# EAGLE design v1.1 (EAGLE 9.6.2)

## Sheet 1 of 3: PIC32 CONNECTION
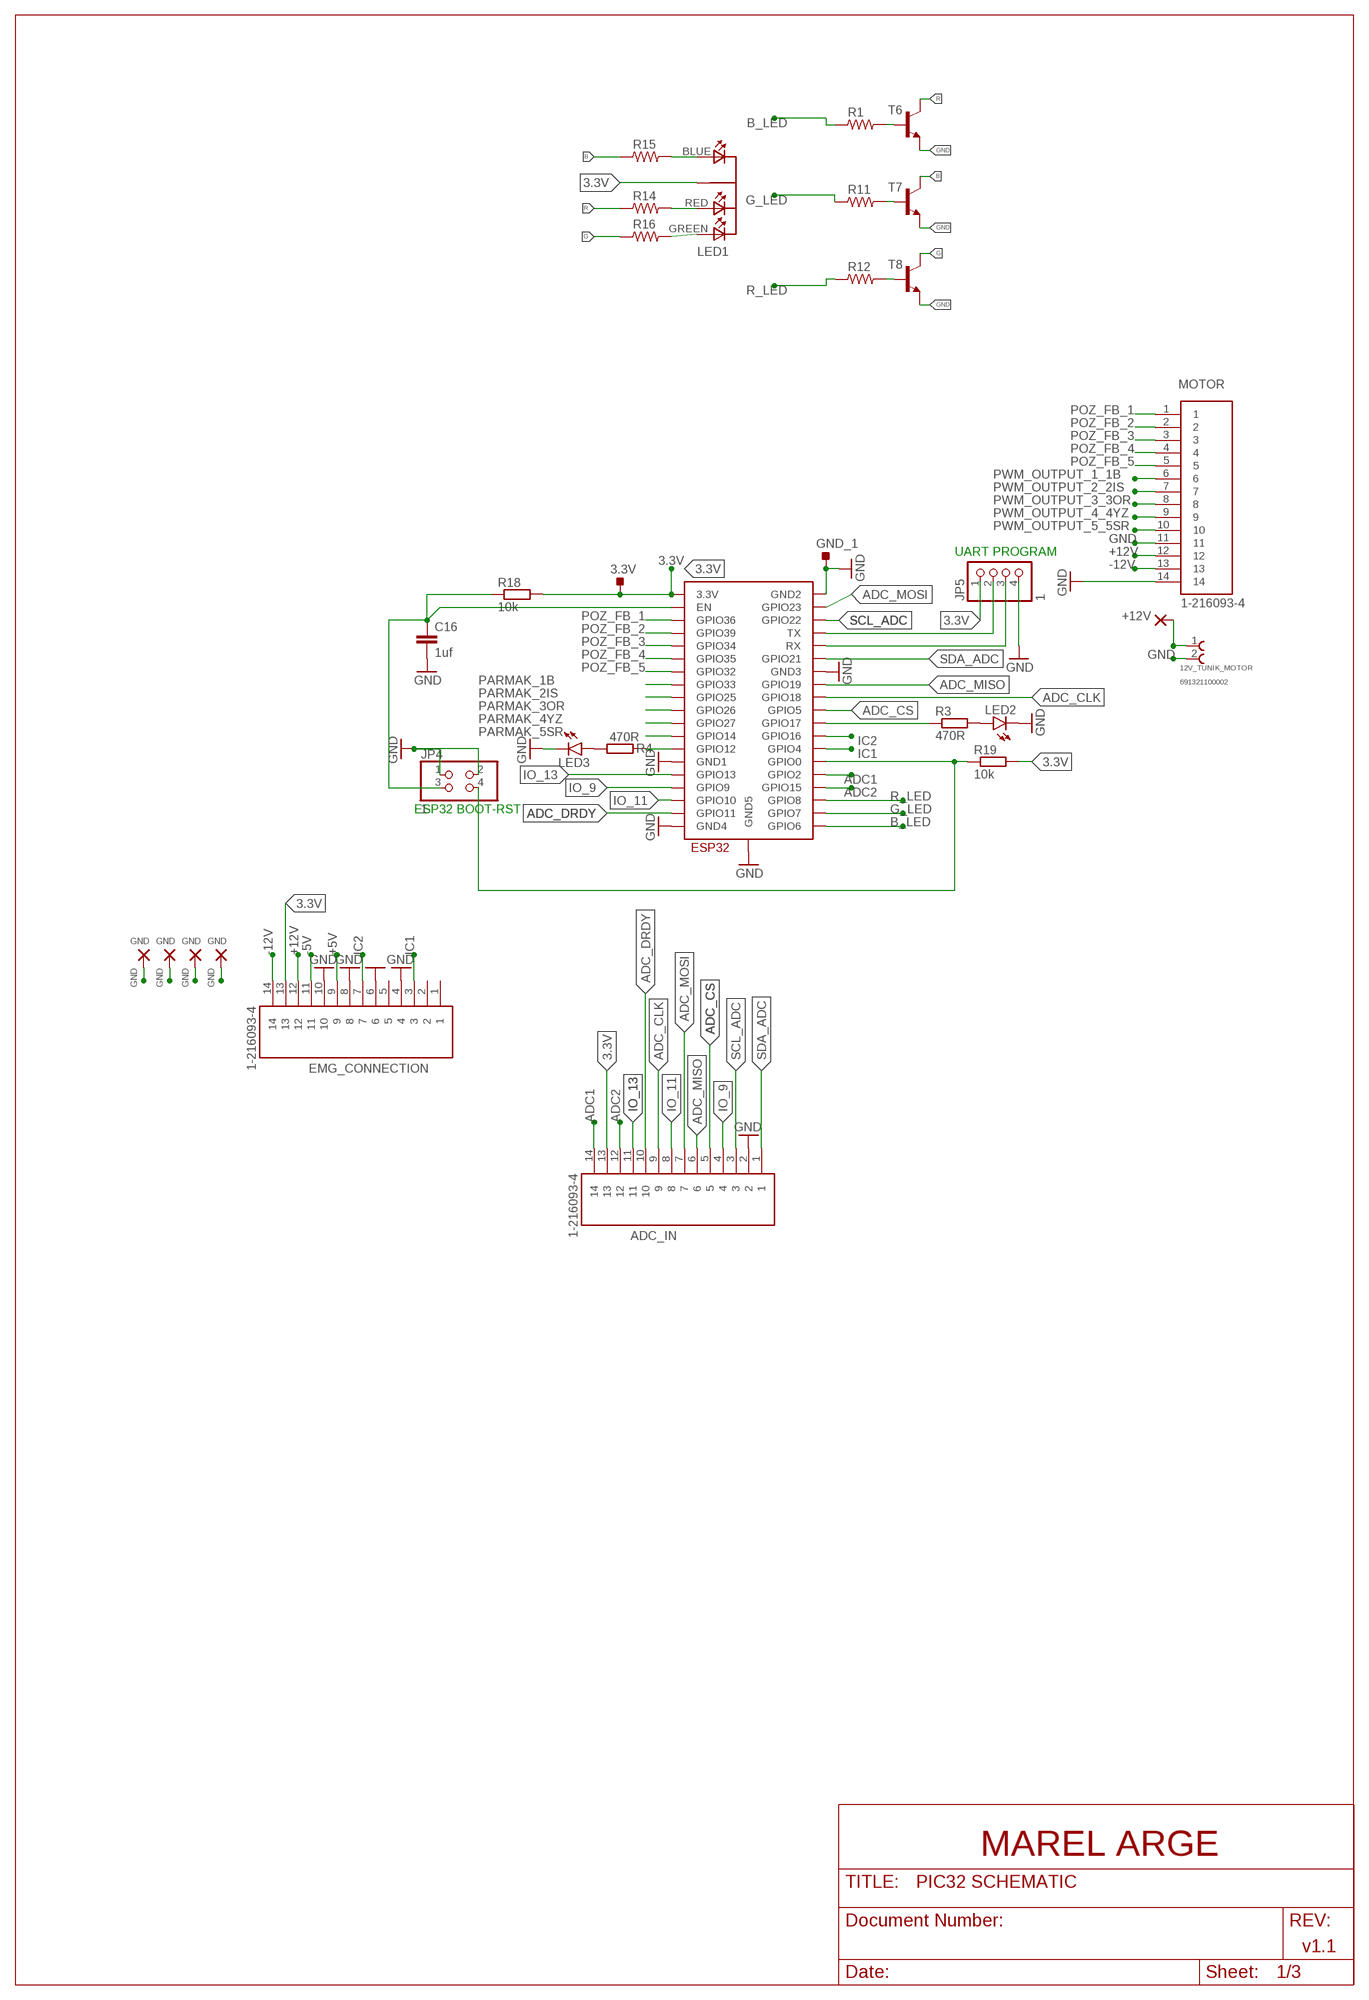
[diagram p0: schematic, sheet 1]
FRAME2 (DINA3_P): MAREL: ARGE

### Parts
3.3V  TESTPOINT_TPS-SMD-10SN  [TESTPOINT_SMD-10SN]
12V_TUNİK_MOTOR  691321100002  [691321100002]
12VOLT  12V  2,54/0,8  [2,54/0,8]
ADC_IN  1-216093-4  [TE_1-216093-4]
C16  1uf  C-EUC0805  [C0805]
EMG_CONNECTION  1-216093-4  [TE_1-216093-4]
GND18  GND  2,54/0,8  [2,54/0,8]
GND19  GND  2,54/0,8  [2,54/0,8]
GND20  GND  2,54/0,8  [2,54/0,8]
GND21  GND  2,54/0,8  [2,54/0,8]
GND_1  TESTPOINT_TPS-SMD-10SN  [TESTPOINT_SMD-10SN]
JP4  1  PINHD-2X2  [2X02]
JP5  1  PINHD-1X4  [1X04]
LED1  LED-DIP-3  [DIP-4]
LED2  LED5MM  [LED5MM]
LED3  LED5MM  [LED5MM]
MOTOR  1-216093-4  [TE_1-216093-4]
R1  100R  RC-MASTER-SMD_RESISTOR0603MP  [RC-MASTER-SMD_R0603MP]
R3  470R  R-EU_R0603  [R0603]
R4  470R  R-EU_R0603  [R0603]
R11  100R  RC-MASTER-SMD_RESISTOR0603MP  [RC-MASTER-SMD_R0603MP]
R12  100R  RC-MASTER-SMD_RESISTOR0603MP  [RC-MASTER-SMD_R0603MP]
R14  100R  RC-MASTER-SMD_RESISTOR0603MP  [RC-MASTER-SMD_R0603MP]
R15  100R  RC-MASTER-SMD_RESISTOR0603MP  [RC-MASTER-SMD_R0603MP]
R16  100R  RC-MASTER-SMD_RESISTOR0603MP  [RC-MASTER-SMD_R0603MP]
R18  10k  R-EU_R0603  [R0603]
R19  10k  R-EU_R0603  [R0603]
T6  TRANSISTORBC846BLT1SOT23-BEC  [SOT23-BEC]
T7  TRANSISTORBC846BLT1SOT23-BEC  [SOT23-BEC]
T8  TRANSISTORBC846BLT1SOT23-BEC  [SOT23-BEC]
U$7  ESP32-WROOM  [ESP32-WROOM]

### Nets
3.3V [power]: 3.3V.TP ADC_IN.13 EMG_CONNECTION.13 JP5.1 LED1.COMMON_CATHODE(COM-CATHODE) R18.2 R19.2 U$7.3V3(3.3V) ; also sheet 2
+5V [power]: EMG_CONNECTION.9 ; also sheet 2,3
+12V [power]: 12V_TUNİK_MOTOR.1 12VOLT.1(P) EMG_CONNECTION.12 MOTOR.12 ; also sheet 2
-5V [power]: EMG_CONNECTION.11 ; also sheet 2
-12V [power]: EMG_CONNECTION.14 MOTOR.13 ; also sheet 2
ADC1: ADC_IN.14 U$7.IO2(GPIO2)
ADC2: ADC_IN.12 U$7.IO15(GPIO15)
ADC_CLK: ADC_IN.9 U$7.IO18(GPIO18)
ADC_CS: ADC_IN.5 U$7.IO5(GPIO5)
ADC_DRDY: ADC_IN.10 U$7.CMD(GPIO11)
ADC_MISO: ADC_IN.6 U$7.IO19(GPIO19)
ADC_MOSI: ADC_IN.7 U$7.IO23(GPIO23)
B: R14.1 T7.C
B_LED: R1.1 U$7.CLK(GPIO6)
ESP32_RESET: C16.1 JP4.3 R18.1 U$7.EN
G: R16.1 T8.C
G_LED: R11.1 U$7.SD0(GPIO7)
GND [power]: 12V_TUNİK_MOTOR.2 ADC_IN.2 C16.2 EMG_CONNECTION.4 EMG_CONNECTION.6 EMG_CONNECTION.8 EMG_CONNECTION.10 GND18.1(P) GND19.1(P) GND20.1(P) GND21.1(P) GND_1.TP JP4.1 JP4.2 JP5.4 LED2.K(C) LED3.K(C) MOTOR.11 MOTOR.14 T6.E T7.E T8.E U$7.GND1 U$7.GND2 U$7.GND3 U$7.GND4 U$7.GND5 ; also sheet 2,3
IC1: EMG_CONNECTION.3 U$7.IO4(GPIO4)
IC2: EMG_CONNECTION.7 U$7.IO16(GPIO16)
IO_9: ADC_IN.4 U$7.SD2(GPIO9)
IO_11: ADC_IN.8 U$7.SD3(GPIO10)
IO_13: ADC_IN.11 U$7.IO13(GPIO13)
N$1: R11.2 T7.B
N$2: R1.2 T6.B
N$6: LED1.RED R14.2
N$7: R12.2 T8.B
N$11: LED1.BLUE R15.2
N$12: LED1.GREEN R16.2
N$16: JP5.2 U$7.TX
N$17: JP5.3 U$7.RX
N$18: JP4.4 R19.1 U$7.IO0(GPIO0)
N$19: LED2.A R3.2
N$20: R3.1 U$7.IO17(GPIO17)
N$21: LED3.A R4.2
N$22: R4.1 U$7.IO12(GPIO12)
PARMAK_1B: U$7.IO33(GPIO33) ; also sheet 3
PARMAK_2IS: U$7.IO25(GPIO25) ; also sheet 3
PARMAK_3OR: U$7.IO26(GPIO26) ; also sheet 3
PARMAK_4YZ: U$7.IO27(GPIO27) ; also sheet 3
PARMAK_5SR: U$7.IO14(GPIO14) ; also sheet 3
POZ_FB_1: MOTOR.1 U$7.SENSOR_VP(GPIO36)
POZ_FB_2: MOTOR.2 U$7.SENSOR_VN(GPIO39)
POZ_FB_3: MOTOR.3 U$7.IO34(GPIO34)
POZ_FB_4: MOTOR.4 U$7.IO35(GPIO35)
POZ_FB_5: MOTOR.5 U$7.IO32(GPIO32)
PWM_OUTPUT_1_1B: MOTOR.6 ; also sheet 3
PWM_OUTPUT_2_2IS: MOTOR.7 ; also sheet 3
PWM_OUTPUT_3_3OR: MOTOR.8 ; also sheet 3
PWM_OUTPUT_4_4YZ: MOTOR.9 ; also sheet 3
PWM_OUTPUT_5_5SR: MOTOR.10 ; also sheet 3
R: R15.1 T6.C
R_LED: R12.1 U$7.SD1(GPIO8)
SCL_ADC: ADC_IN.3 U$7.IO22(GPIO22)
SDA_ADC: ADC_IN.1 U$7.IO21(GPIO21)
Unconnected: EMG_CONNECTION.1 EMG_CONNECTION.2 EMG_CONNECTION.5

### Notes on the sheet
- UART PROGRAM
- ESP32 BOOT-RST
- -12V | +12V
- MAREL ARGE
- PIC32 SCHEMATIC

## Sheet 2 of 3: REGULATOR
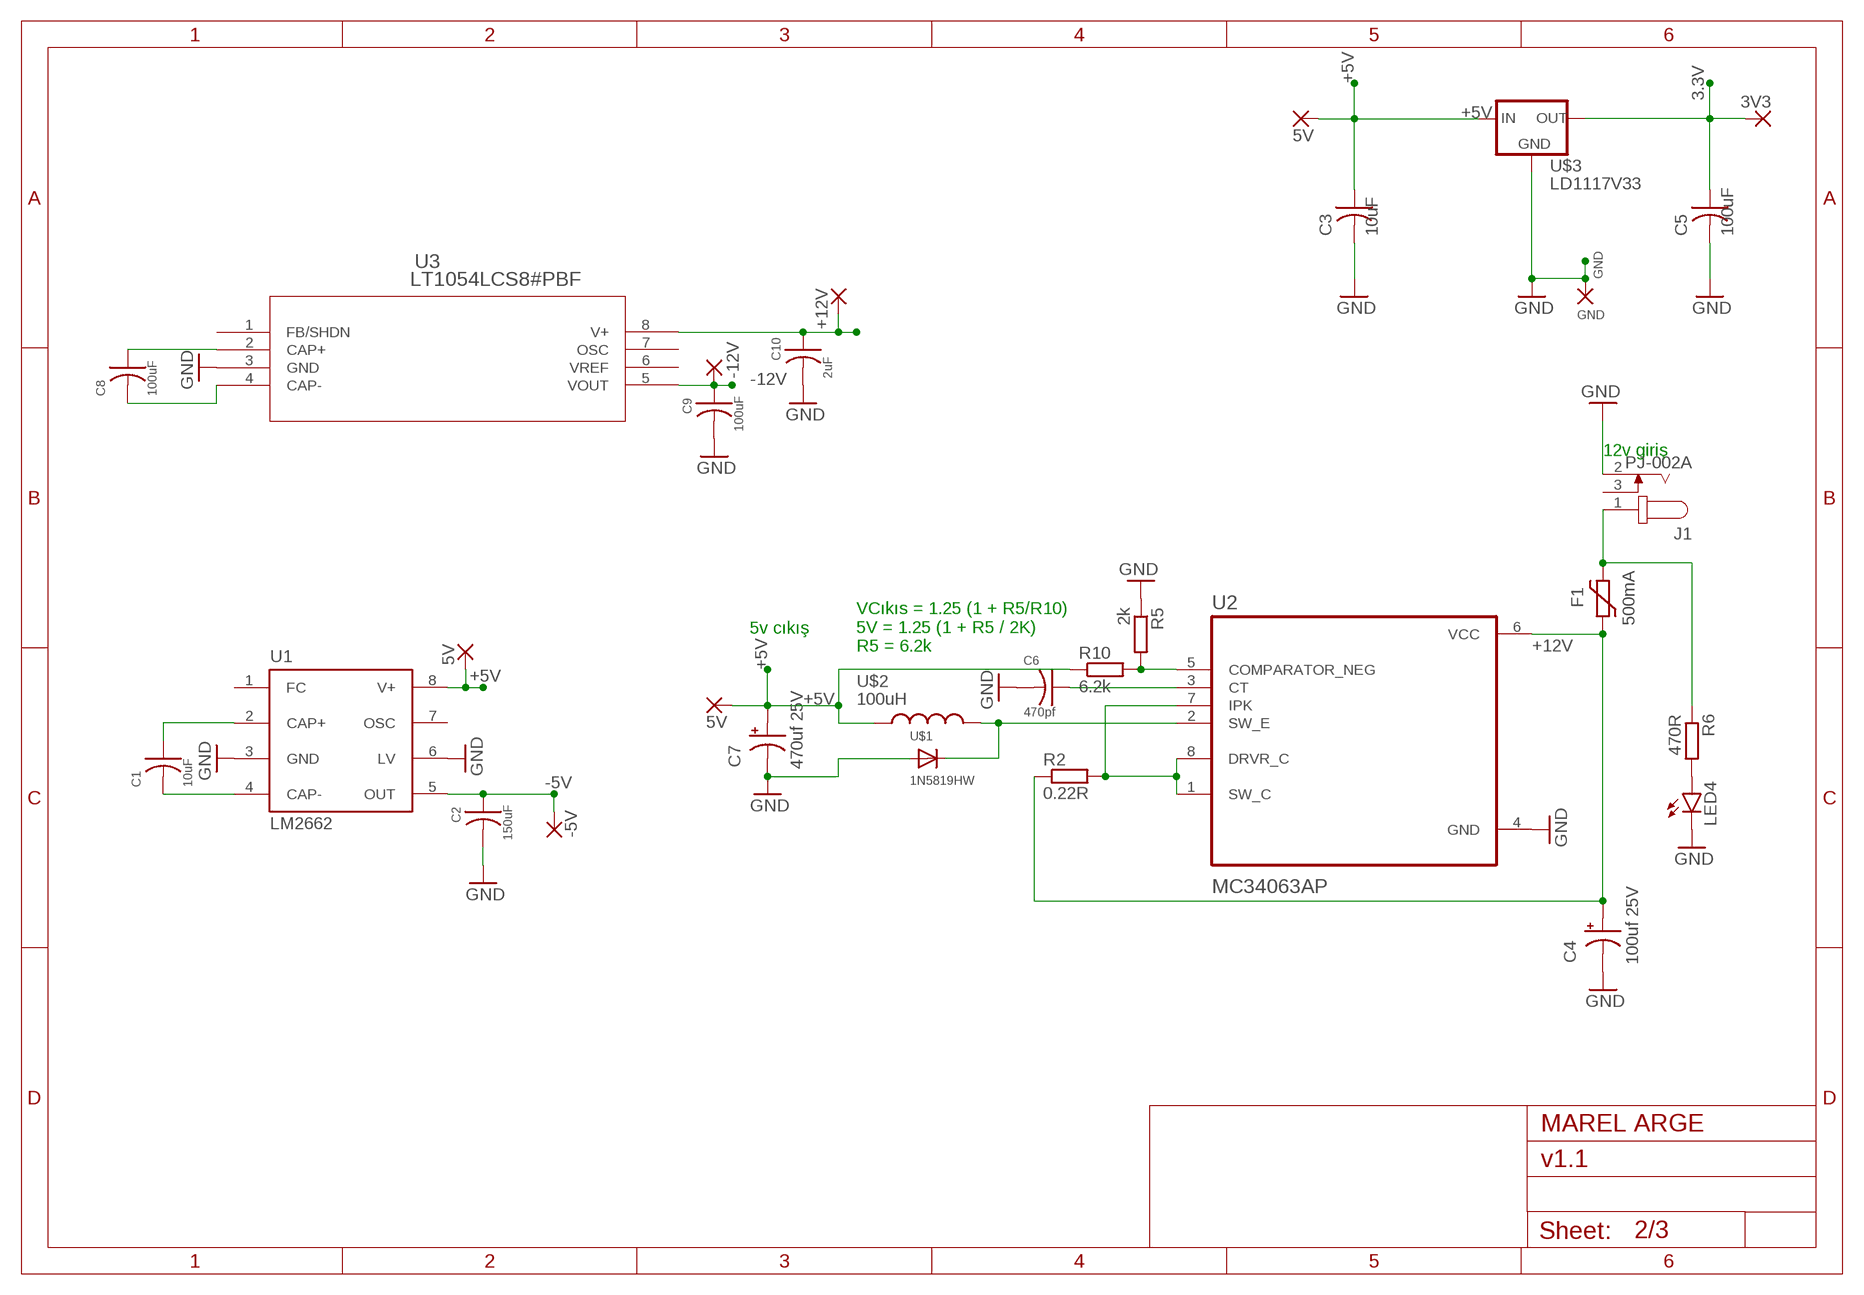
[diagram p1: schematic, sheet 2]

### Parts
3V3_1  3V3  2,54/0,8  [2,54/0,8]
5V  5V  2,54/0,8  [2,54/0,8]
5V1  5V  2,54/0,8  [2,54/0,8]
+5V  5V  2,54/0,8  [2,54/0,8]
+12V  +12V  2,54/0,8  [2,54/0,8]
-5V  -5V  2,54/0,8  [2,54/0,8]
-12V  -12V  2,54/0,8  [2,54/0,8]
C1  10uF  C-USC1206  [C1206]
C2  150uF  C-USC1206  [C1206]
C3  10uF  C-USC1206  [C1206]
C4  100uf 25V  T491X107K025AT  [X]
C5  100uF  C-USC1206  [C1206]
C6  470pf  C-USC1206  [C1206]
C7  470uf 25V  T491X107K025AT  [X]
C8  100uF  C-USC1206  [C1206]
C9  100uF  C-USC1206  [C1206]
C10  2uF  C-USC1206  [C1206]
F1  500mA  1206L  [1206L]
GND13  GND  2,54/0,8  [2,54/0,8]
J1  PJ-002A  [CUI_PJ-002A]
LED4  LED5MM  [LED5MM]
R2  0.22R  R-EU_R2512  [R2512]
R5  2k  R-EU_R0805  [R0805]
R6  470R  R-EU_R0603  [R0603]
R10  6.2k  R-EU_R0805  [R0805]
U1  LM2662  [SO08]
U2  MC34063AP  [DIP794W45P254L959H508Q8]
U3  LT1054LCS8#PBF  [SO-8_S]
U$1  1N5819HW  [SOD-123-EDITED]
U$2  100uH  INDUCTOR7070  [L7070]
U$3  LD1117V33  [LD1117V33]

### Nets
3.3V [power]: 3V3_1.1(P) C5.1 U$3.OUT ; also sheet 1
12_IN [power]: F1.P$2 J1.1 R6.1
+5V [power]: 5V1.1(P) 5V.1(P) +5V.1(P) C3.1 C7.A R10.1 U1.8(V+) U$2.1 U$3.IN ; also sheet 1,3
+12V [power]: +12V.1(P) C4.A C10.1 F1.P$1 R2.1 U2.6(VCC) U3.8(V+) ; also sheet 1
-5V [power]: -5V.1(P) C2.1 U1.5(OUT) ; also sheet 1
-12V [power]: -12V.1(P) C9.1 U3.5(VOUT) ; also sheet 1
GND [power]: C2.2 C3.2 C4.C C5.2 C6.2 C7.C C9.2 C10.2 GND13.1(P) J1.2 LED4.K(C) R5.1 U1.3(GND) U1.6(LV) U2.4(GND) U3.3(GND) U$1.A U$3.GND ; also sheet 1,3
N$3: C1.1 U1.2(CAP+)
N$4: C1.2 U1.4(CAP-)
N$5: R2.2 U2.1(SW_C) U2.7(IPK) U2.8(DRVR_C)
N$9: C8.1 U3.2(CAP+)
N$10: U2.2(SW_E) U$1.C U$2.2
N$13: R5.2 R10.2 U2.5(COMPARATOR_NEG)
N$14 [power]: C6.1 U2.3(CT)
N$15: C8.2 U3.4(CAP-)
N$25: LED4.A R6.2
Unconnected: J1.3 U1.1(FC) U1.7(OSC) U3.1(FB/SHDN) U3.7(OSC)

### Notes on the sheet
- 12v giriş
- 5v cıkış
- VCıkıs = 1.25 (1 + R5/R10) 
  5V = 1.25 (1 + R5 / 2K) 
  R5 = 6.2k
- MAREL ARGE

## Sheet 3 of 3: MOTOR DRIVER
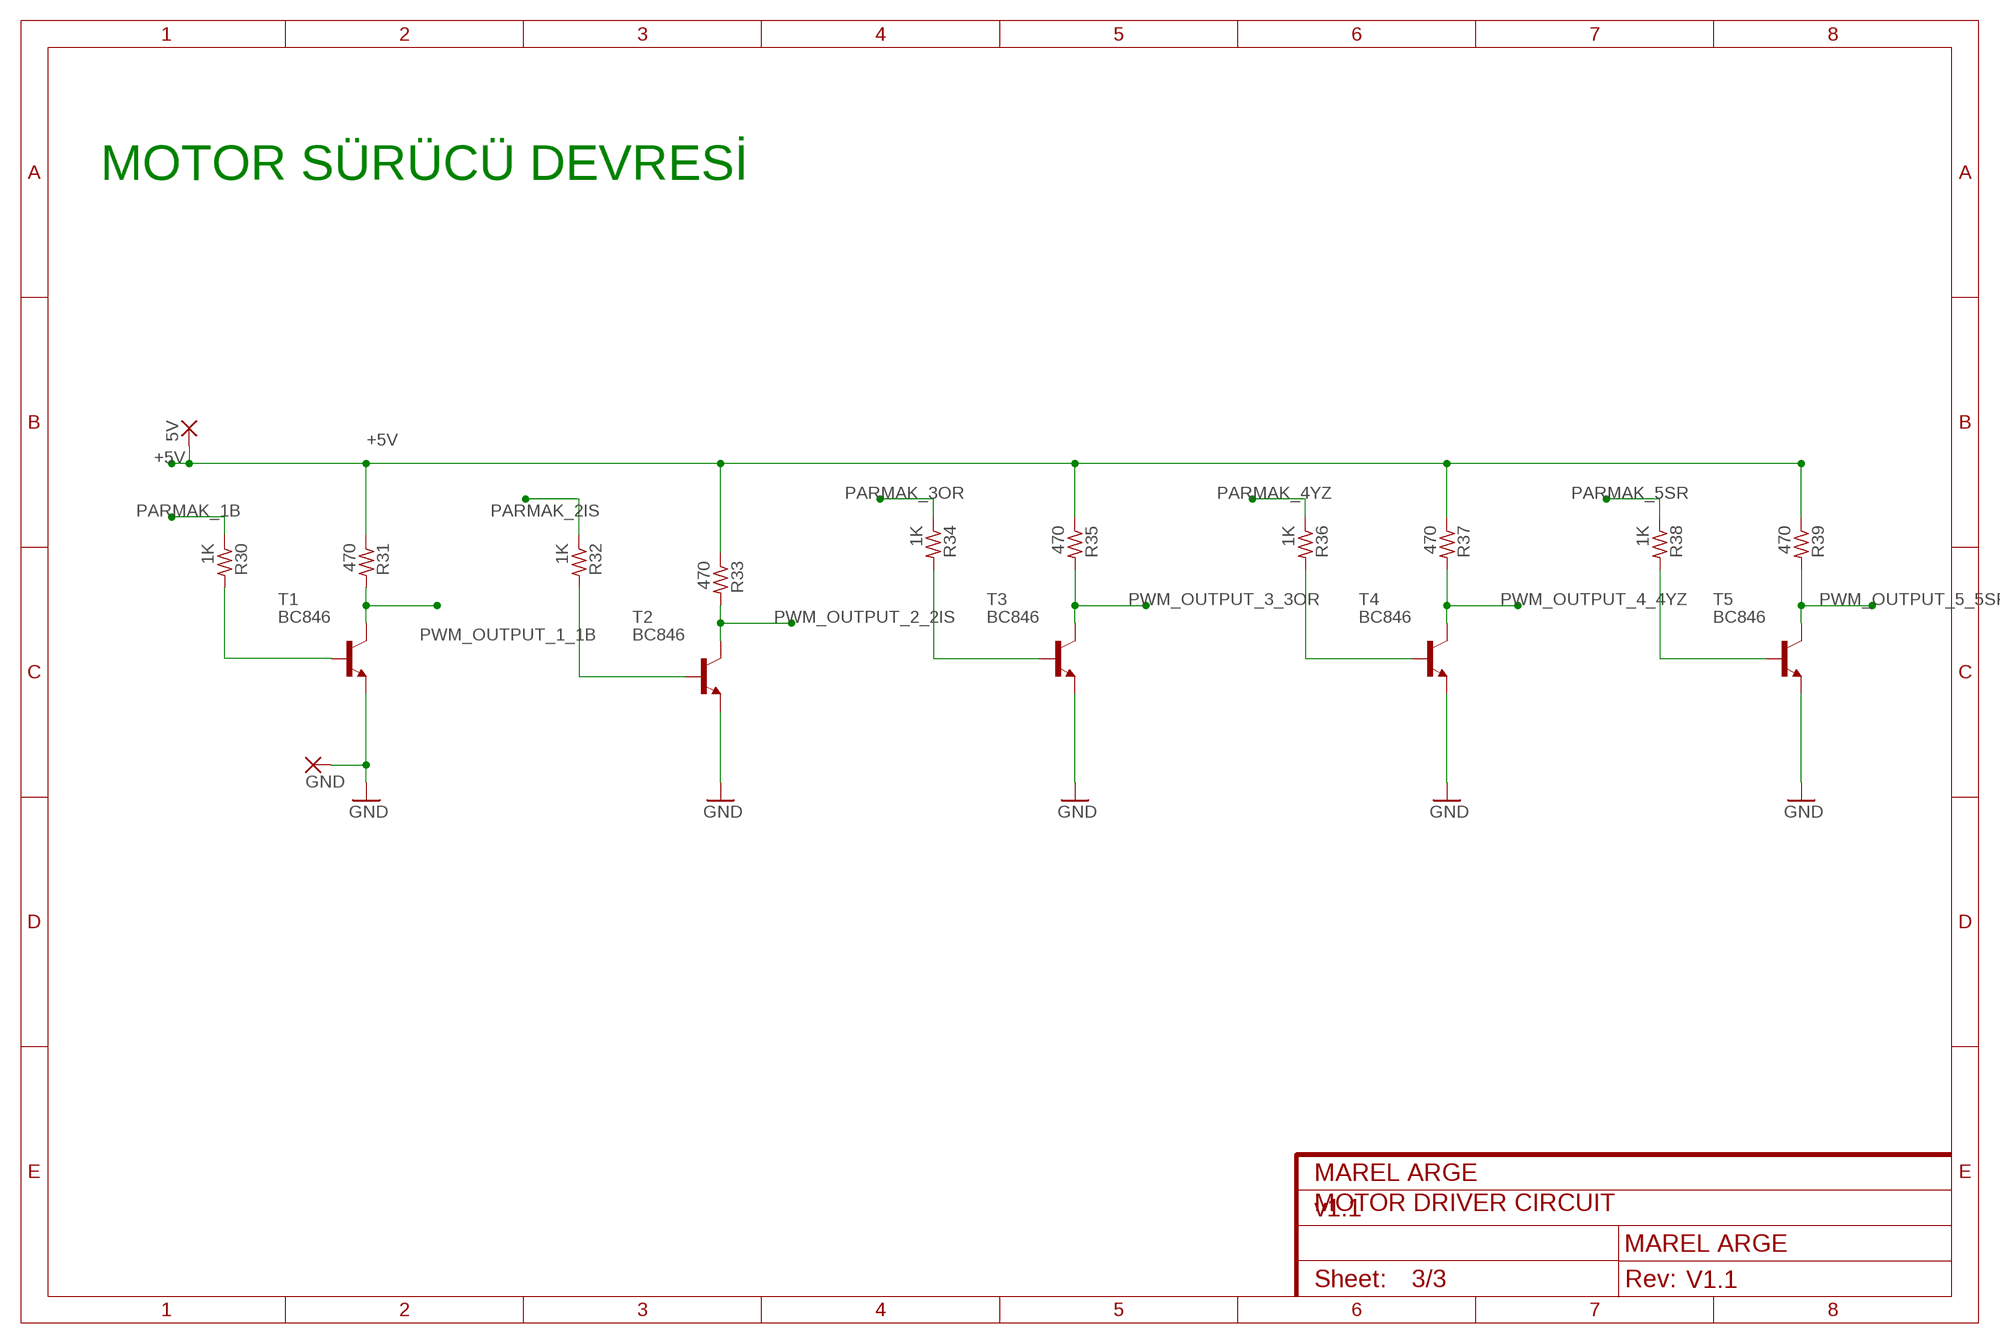
[diagram p2: schematic, sheet 3]
FRAME4 (FRAME-A4L): CNAME: MAREL ARGE; CREVISION: V1.1; DESIGNER: MAREL ARGE; TITLE: MOTOR DRIVER CIRCUIT

### Parts
_5VOLT  5V  2,54/0,8  [2,54/0,8]
GND_  GND  2,54/0,8  [2,54/0,8]
R30  1K  R-US_M0805  [M0805]
R31  470  R-US_M0805  [M0805]
R32  1K  R-US_M0805  [M0805]
R33  470  R-US_M0805  [M0805]
R34  1K  R-US_M0805  [M0805]
R35  470  R-US_M0805  [M0805]
R36  1K  R-US_M0805  [M0805]
R37  470  R-US_M0805  [M0805]
R38  1K  R-US_M0805  [M0805]
R39  470  R-US_M0805  [M0805]
T1  BC846  [SOT23]
T2  BC846  [SOT23]
T3  BC846  [SOT23]
T4  BC846  [SOT23]
T5  BC846  [SOT23]

### Nets
+5V [power]: _5VOLT.1(P) R31.1 R33.1 R35.1 R37.1 R39.1 ; also sheet 1,2
GND [power]: GND_.1(P) T1.2(E) T2.2(E) T3.2(E) T4.2(E) T5.2(E) ; also sheet 1,2
N$45: R30.2 T1.1(B)
N$46: R32.2 T2.1(B)
N$47: R34.2 T3.1(B)
N$48: R36.2 T4.1(B)
N$49: R38.2 T5.1(B)
PARMAK_1B: R30.1 ; also sheet 1
PARMAK_2IS: R32.1 ; also sheet 1
PARMAK_3OR: R34.1 ; also sheet 1
PARMAK_4YZ: R36.1 ; also sheet 1
PARMAK_5SR: R38.1 ; also sheet 1
PWM_OUTPUT_1_1B: R31.2 T1.3(C) ; also sheet 1
PWM_OUTPUT_2_2IS: R33.2 T2.3(C) ; also sheet 1
PWM_OUTPUT_3_3OR: R35.2 T3.3(C) ; also sheet 1
PWM_OUTPUT_4_4YZ: R37.2 T4.3(C) ; also sheet 1
PWM_OUTPUT_5_5SR: R39.2 T5.3(C) ; also sheet 1

### Notes on the sheet
- MOTOR SÜRÜCÜ DEVRESİ

## Power pins joined to a net without a drawn wire
VREF: U3.6(VREF)

## Library data of the parts
3.3V GND_1 = Mareltek Detector Hand Library:TESTPOINT_TPS: TEST POINT PAD; BOM: EXCLUDE
3V3_1 5V 5V1 12VOLT +5V +12V -5V -12V _5VOLT GND13 GND18-GND21 GND_ = wirepad:2,54/0,8: THROUGH-HOLE PAD
12V_TUNİK_MOTOR = 691321100002:691321100002: WR-TBL Serie 3211 - 3.50mm Vertical PCB Header , 2 Pins Con_TBL_Pluggable_3.50_PCB_V_6913211000xx_691321100002 <http://katalog.we-online.de/media/images/eican/Con_TBL_Pluggable_3.50_PCB_V_6913211000xx_pf2.jpg> Details see: http://katalog.we-online.de/en/em/TBL_3_50_3211_VERTICAL_PCB_HEADER_69132110000X Created 2014-12-22, aslant tao 2014 (C) Würth Elektronik; AVAILABILITY: Unavailable; DESCRIPTION: 2 Position Terminal Block Header, Male Pins, Shrouded _4 Side_ 0.138 _3.50mm_ Vertical Through Hole; MF: Wurth Electronics; MP: 691321100002; PACKAGE: None; PRICE: None
ADC_IN EMG_CONNECTION MOTOR = 1-216093-4:1-216093-4; AVAILABILITY: Unavailable; CENTERLINE_PITCH: 2.54 mm[.1 in]; COMMENT: 1-216093-4; DESCRIPTION: Conn IDC Connector PL 14 POS 2.54mm IDT RA Cable Mount Loose Piece; EU_ROHS_COMPLIANCE: Compliant; MF: TE Connectivity; MP: 1-216093-4; NUMBER_OF_POSITIONS: 14; PACKAGE: None; PRICE: None; PRODUCT_TYPE: Connector; TE_PURCHASE_URL: https://www.te.com/usa-en/product-1-216093-4.html?te_bu=Cor&te_type=disp&te_campaign=seda_glo_cor-seda-global-disp-prtnr-fy19-seda-model-bom-cta_sma-317_1&elqCampaignId=32493
C1-C3 C5 C6 C8-C10 = adafruit:C-US: CAPACITOR, American symbol
C4 C7 = Volks73-Kemet:T491?*: Tantalum Surface Mount Capacitor - Standard Tantalum T491 Series Industrial Grade MnO2 Documentation Datasheet <http://www.kemet.com/Lists/ProductCatalog/Attachments/254/KEM_T2005_T491.pdf> Overview The KEMET T491 Series, designed specifially for today’s highly automated surface mount processes and equipment, is the leading choice for surface mount designs. The T491 combines KEMET’s proven solid tantalum technology, acclaimed and respected throughout the world, with the latest in materials, processes and automation, resulting in unsurpassed total performance and value. This product meets or exceeds the requirements of EIA standard 535BAAC. This series is classifid as MSL (Moisture Sensitivity Level) 1 under J STD 020: unlimited flor life time at ≤30°C / 85% RH. The T491 standard terminations are available in 100% matte tin and provide excellent wetting characteristics and compatibility with today's surface mount solder systems. Tin/lead (Sn/Pb) terminations are available upon request for any part number. Gold-plated terminations are also available for use with conductive epoxy attachment processes. Standard packaging of these devices is tape and reel in accordance with EIA 481. This system provides perfect compatibility with all tape-fed placement units. Benefits Meets or exceeds EIA Standard 535BAAC Taped and reeled per EIA 481 Symmetrical, compliant terminations Optional gold-plated terminations Laser-marked case 100% surge current test on C, D, E, U, V, X sizes Halogen free epoxy Capacitance 0.1 µF to 1,000 µF Tolerance ±10%, ±20% Voltage 2.5 – 50 VDC Extended range values Low profie case sizes RoHS Compliant and lead-free terminations (See www.kemet.com for transition information) Operating temperature: -55ºC to +125ºC; CAPACITANCE: 100uF; CATEGORY: Capacitors; DESCRIPTION: CAP TANT 100UF 25V 10% 2917; DOCUMENTATION_LINK: <a href="http://www.kemet.com/Lists/ProductCatalog/Attachments/254/KEM_T2005_T491.pdf">Datasheet</a>; DOCUMENTATION_URL: http://www.kemet.com/Lists/ProductCatalog/Attachments/254/KEM_T2005_T491.pdf; ESR: 300 mOhm; FAMILY: Tantalum Capacitors; FEATURES: General Purpose; HEIGHT-SEATED: 0.169" (4.30mm); LEAD_SPACING: -; MANUFACTURER: Kemet; MANUFACTURER_SIZE_CODE: X; MOUNTING_TYPE: Surface Mount; OPERATING_TEMPERATURE: -55C ~ 125C; PACKAGE: 2917 (7343 Metric); PART_NUMBER: T491X107K025AT; SERIES: T491; SIZE: 0.287" L x 0.169" W (7.30mm x 4.30mm); SUPPLIER_ITEM_INFO: http://www.digikey.com/product-detail/en/T491X107K025AT/399-8410-1-ND/3472133; SUPPLIER_ITEM_LINK: <a href="">Details</a>; SUPPLIER_ITEM_NUMBER: 399-8410-1-ND; SUPPLIER_LINK: <a href="http://www.digikey.com">Home Page</a>; SUPPLIER_NAME: Digi-Key; SUPPLIER_URL: http://www.digikey.com; TOLERANCE: 10%; TYPE: Molded; VOLTAGE-RATED: 25V
C16 = rcl:C-EU: CAPACITOR, European symbol; SPICEPREFIX: C
F1 = ptc-littlefuse:1206L
J1 = PJ-002A:PJ-002A: 2.0 mm Center Pin, 2.5 A, Right Angle, Through Hole, Dc Power Jack Connector Check availability <https://pricing.snapeda.com/parts/PJ-002A/CUI%20Devices/view-part?ref=eda>; AVAILABILITY: In Stock; CHECK_PRICES: https://www.snapeda.com/parts/PJ-002A/CUI+Devices/view-part/?ref=eda; CUI_PURCHASE_URL: https://www.cuidevices.com/product/interconnect/connectors/dc-power-connectors/jacks/pj-002a?utm_source=snapeda.com&utm_medium=referral&utm_campaign=snapedaBOM; DESCRIPTION: 2.0 x 6.5 mm, 2.5 A, Horizontal, Through Hole, Dc Power Jack Connector; MF: CUI Devices; MP: PJ-002A; PACKAGE: None; PRICE: None; PURCHASE-URL: https://www.snapeda.com/api/url_track_click_mouser/?unipart_id=287588&manufacturer=CUI Devices&part_name=PJ-002A&search_term=None; SNAPEDA_LINK: https://www.snapeda.com/parts/PJ-002A/CUI+Devices/view-part/?ref=snap
JP4 = pinhead:PINHD-2X2: PIN HEADER
JP5 = pinhead:PINHD-1X4: PIN HEADER
LED1 = _led-rgb:LED-DIP-3: RGB DIP LED Edited: brunql DIP 4 Pin Special for AmbilightUSB
LED2-LED4 = led:LED: LED OSRAM: - CHIPLED LG R971, LG N971, LY N971, LG Q971, LY Q971, LO R971, LY R971 LH N974, LH R974 LS Q976, LO Q976, LY Q976 LO Q996 - Hyper CHIPLED LW Q18S LB Q993, LB Q99A, LB R99A - SideLED LS A670, LO A670, LY A670, LG A670, LP A670 LB A673, LV A673, LT A673, LW A673 LH A674 LY A675 LS A676, LA A676, LO A676, LY A676, LW A676 LS A679, LY A679, LG A679 - Hyper Micro SIDELED® LS Y876, LA Y876, LO Y876, LY Y876 LT Y87S - SmartLED LW L88C, LW L88S LB L89C, LB L89S, LG L890 LS L89K, LO L89K, LY L89K LS L896, LA L896, LO L896, LY L896 - TOPLED LS T670, LO T670, LY T670, LG T670, LP T670 LSG T670, LSP T670, LSY T670, LOP T670, LYG T670 LG T671, LOG T671, LSG T671 LB T673, LV T673, LT T673, LW T673 LH T674 LS T676, LA T676, LO T676, LY T676, LB T676, LH T676, LSB T676, LW T676 LB T67C, LV T67C, LT T67C, LS T67K, LO T67K, LY T67K, LW E67C LS E67B, LA E67B, LO E67B, LY E67B, LB E67C, LV E67C, LT E67C LW T67C LS T679, LY T679, LG T679 LS T770, LO T770, LY T770, LG T770, LP T770 LB T773, LV T773, LT T773, LW T773 LH T774 LS E675, LA E675, LY E675, LS T675 LS T776, LA T776, LO T776, LY T776, LB T776 LHGB T686 LT T68C, LB T68C - Hyper Mini TOPLED® LB M676 - Mini TOPLED Santana® LG M470 LS M47K, LO M47K, LY M47K Source: http://www.osram.convergy.de LUXEON: - LUMILED® LXK2-PW12-R00, LXK2-PW12-S00, LXK2-PW14-U00, LXK2-PW14-V00 LXK2-PM12-R00, LXK2-PM12-S00, LXK2-PM14-U00 LXK2-PE12-Q00, LXK2-PE12-R00, LXK2-PE12-S00, LXK2-PE14-T00, LXK2-PE14-U00 LXK2-PB12-K00, LXK2-PB12-L00, LXK2-PB12-M00, LXK2-PB14-N00, LXK2-PB14-P00, LXK2-PB14-Q00 LXK2-PR12-L00, LXK2-PR12-M00, LXK2-PR14-Q00, LXK2-PR14-R00 LXK2-PD12-Q00, LXK2-PD12-R00, LXK2-PD12-S00 LXK2-PH12-R00, LXK2-PH12-S00 LXK2-PL12-P00, LXK2-PL12-Q00, LXK2-PL12-R00 Source: www.luxeon.com KINGBRIGHT: KA-3528ASYC Source: www.kingbright.com
R1 R11 R12 R14-R16 = Mareltek Detector Hand Library:RC-MASTER-SMD_RESISTOR: RESISTOR; SPICEPREFIX: R
R2-R6 R10 R18 R19 = rcl:R-EU_: RESISTOR, European symbol; SPICEPREFIX: R
R30-R39 = Saldiyos_Lbr:R-US_: RESISTOR, American symbol
T1-T5 = transistor:BC846: NPN TRANSISTOR
T6-T8 = Mareltek Detector Hand Library:TRANSISTOR: NPN Transistror BF959 corrected 2008.03.06
U1 = bt_regulator:LM2662: The LM2662/LM2663 CMOS charge-pump voltage converter inverts a positive voltage in the range of 1.5V to 5.5 V to the corresponding negative voltage. The LM2662/LM2663 uses two low cost capacitors to provide 200 mA of output current without the cost, size, and EMI related to inductor based converters. With an operating current of only 300 μA and operating efficiency greater than 90% at most loads, the LM2662/LM2663 provides ideal performance for battery powered systems. The LM2662/LM2663 may also be used as a positive voltage doubler. datasheet.pdf <https://rocelec.widen.net/view/pdf/cenmqdu1m5/lm2662.pdf?t.download=true&u=5oefqw>
U2 = MC34063AP:MC34063AP: Check availability <https://pricing.snapeda.com/parts/MC34063AP/Texas%20Instruments/view-part?ref=eda>; AVAILABILITY: In Stock; CHECK_PRICES: https://www.snapeda.com/parts/MC34063AP/Texas+Instruments/view-part/?ref=eda; DESCRIPTION: 1.5-A boost, buck, inverting switching regulator, operation from 0°C to 70°C; MF: Texas Instruments; MP: MC34063AP; PACKAGE: PDIP-8 Texas; PRICE: None; PURCHASE-URL: https://www.snapeda.com/api/url_track_click_mouser/?unipart_id=4800532&manufacturer=Texas Instruments&part_name=MC34063AP&search_term=None; SNAPEDA_LINK: https://www.snapeda.com/parts/MC34063AP/Texas+Instruments/view-part/?ref=snap
U3 = LT1054LCS8_PBF:LT1054LCS8#PBF: Check availability <https://pricing.snapeda.com/parts/LT1054LCS8%23PBF/Analog%20Devices/view-part?ref=eda>; AVAILABILITY: In Stock; CHECK_PRICES: https://www.snapeda.com/parts/LT1054LCS8%23PBF/Analog+Devices/view-part/?ref=eda; DESCRIPTION: Charge Pump Switching Regulator IC Positive or Negative Adjustable (Fixed) 2.5V (-Vin, 2Vin) 1 Output 120mA 8-SOIC (0.154, 3.90mm Width); MF: Analog Devices; MP: LT1054LCS8#PBF; PACKAGE: SO-8 Linear Technology; PRICE: None; PURCHASE-URL: https://www.snapeda.com/api/url_track_click_mouser/?unipart_id=596549&manufacturer=Analog Devices&part_name=LT1054LCS8#PBF&search_term=None; SNAPEDA_LINK: https://www.snapeda.com/parts/LT1054LCS8%23PBF/Analog+Devices/view-part/?ref=snap
U$1 = MTM_untested:1N5819HW
U$2 = smd-inductors:INDUCTOR
U$3 = LD1117V33:LD1117V33
U$7 = ESP32:ESP32-WROOM

## Net classes
0 default: width 0.508 mm, drill 0.203 mm, clearance 0.203 mm
1 power: width 0.889 mm, drill 0.203 mm, clearance 0.203 mm

## Board
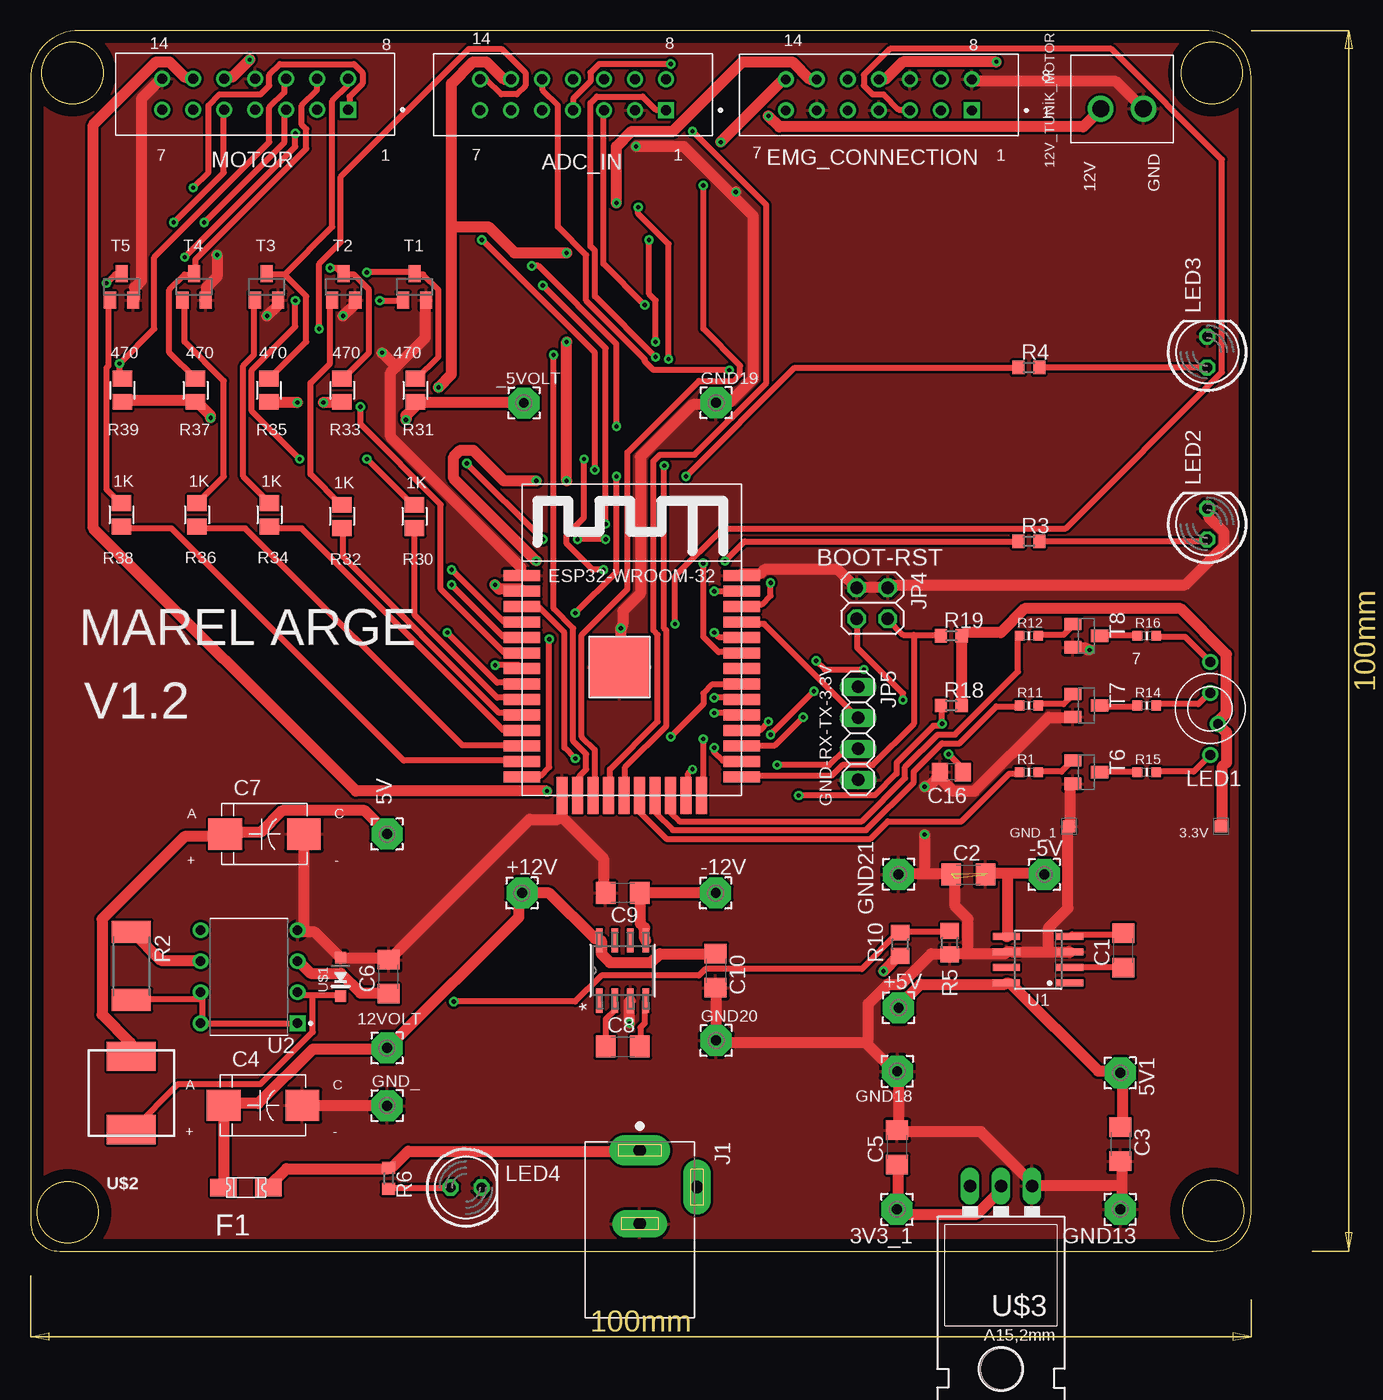
[diagram p3: board, top side]
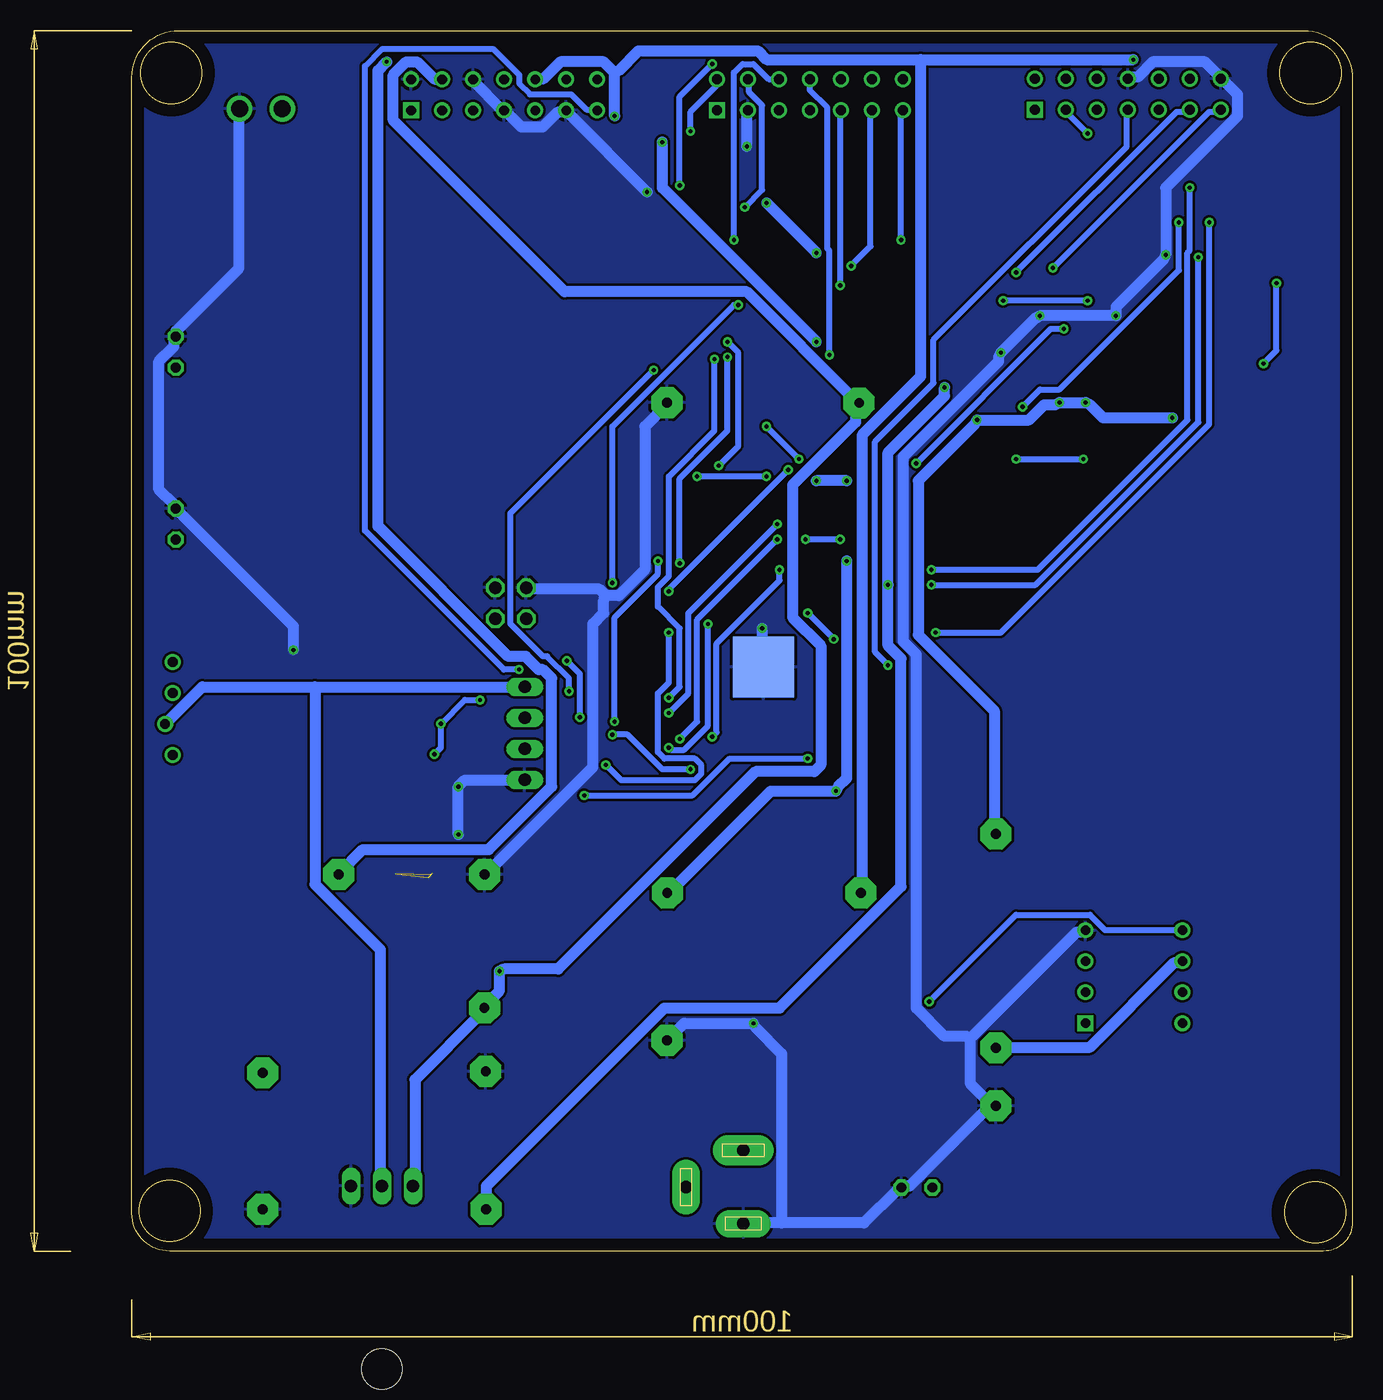
[diagram p4: board, bottom side, seen from below]

Size 100 x 100 mm. Coordinates in mm from the lower left corner, seen from the top.
Outline: 96.16,100 3.98,100 arc90 0,96.03 0,2.38 arc90 2.38,0 96.9,0 arc90 100,3.1 100,96.16 arc90 96.16,100
Outline: circle at 3.43,96.52 radius 2.51
Outline: circle at 3.05,3.17 radius 2.51
Outline: circle at 96.9,3.3 radius 2.51
Outline: circle at 96.77,96.52 radius 2.51
Copper layers (1*16): Top 0.035mm / dielectric 1.5mm / Bottom 0.035mm
Design rules "default *": minimum track width 6mil, minimum drill 0.35mm, track to track 6mil, track to pad 6mil, pad to pad 6mil, via to via 6mil, smd to smd 6mil, copper to edge 40mil, drill to drill 6mil, minimum pad ring 10mil, minimum via ring 8mil, stop-mask expansion 4mil, vias tented up to drill 0mil, thermal gap 10mil

### Footprints (pad centres in the part's own frame; a part is rotated, then mirrored left to right if it is on the bottom)
TESTPOINT_SMD-10SN = smd 1 x 1: TP 0,0
2,54/0,8 = drill 0.813 pad 2.54 octagon: 1 0,0
691321100002 = drill 1.4: 1 -1.75,0; 2 1.75,0
TE_1-216093-4 = drill 0.8 pad 1.15 square: 1 0,0 | drill 0.8 pad 1.15: 2 2.54,0; 3 5.08,0; 4 7.62,0; 5 10.16,0; 6 12.7,0; 7 15.24,0; 8 0,-2.54; 9 2.54,-2.54; 10 5.08,-2.54; 11 7.62,-2.54; 12 10.16,-2.54; 13 12.7,-2.54; 14 15.24,-2.54
C1206 = smd 1.6 x 1.8: 1 -1.4,0; 2 1.4,0
X = smd 2.77 x 2.55: A -3.22,0; C 3.22,0
C0805 = smd 1.3 x 1.5: 1 -0.95,0; 2 0.95,0
1206L = smd 2.16 x 1.4: P$1 -1.85,0; P$2 1.85,0
CUI_PJ-002A = drill 1 pad 2.5 long: 1 0,0 | drill 1 pad 2.25 long: 2 6,0; 3 3,4.7
2X02 = drill 1.016 octagon: 1 -1.27,-1.27; 2 -1.27,1.27; 3 1.27,-1.27; 4 1.27,1.27
1X04 = drill 1.016 long: 1 -3.81,0; 2 -1.27,0; 3 1.27,0; 4 3.81,0
DIP-4 = drill 0.8: BLUE 0,5.08; COMMON_CATHODE -0.635,2.54; GREEN 0,-2.54; RED 0,0
LED5MM = drill 0.813 octagon: A -1.27,0; K 1.27,0
RC-MASTER-SMD_R0603MP = smd 0.8 x 0.8: 1 -0.762,0; 2 0.762,0
R2512 = smd 1.8 x 3.2: 1 -2.8,0; 2 2.8,0
R0603 = smd 1 x 1.1: 1 -0.85,0; 2 0.85,0
R0805 = smd 1.3 x 1.5: 1 -0.95,0; 2 0.95,0
M0805 = smd 1.3 x 1.6: 1 -0.95,0; 2 0.95,0
SOT23 = smd 1 x 1.4: 1 -0.95,-1.1; 2 0.95,-1.1; 3 0,1.1
SOT23-BEC = smd 1 x 1.4: B -0.95,-1.1; C 0,1.1; E 0.95,-1.1
SO08 = smd 0.6 x 2.2: 1 -1.905,-2.6; 2 -0.635,-2.6; 3 0.635,-2.6; 4 1.905,-2.6; 5 1.905,2.6; 6 0.635,2.6; 7 -0.635,2.6; 8 -1.905,2.6
DIP794W45P254L959H508Q8 = drill 0.78 pad 1.13 square: 1 -3.97,3.81 | drill 0.78 pad 1.13: 2 -3.97,1.27; 3 -3.97,-1.27; 4 -3.97,-3.81; 5 3.97,-3.81; 6 3.97,-1.27; 7 3.97,1.27; 8 3.97,3.81
SO-8_S = smd 1.981 x 0.533: 1 -2.464,1.905; 2 -2.464,0.635; 3 -2.464,-0.635; 4 -2.464,-1.905; 5 2.464,-1.905; 6 2.464,-0.635; 7 2.464,0.635; 8 2.464,1.905
SOD-123-EDITED = smd 0.95 x 0.9: A 1.575,0; C -1.575,0
L7070 = smd 2.4 x 4: 1 -3,0; 2 3,0
LD1117V33 = drill 1.016 long: GND -2.54,-8.89; IN 2.54,-8.89; OUT 0,-8.89 | hole 3.302: 0,6.096
ESP32-WROOM = smd 3 x 0.9: 3V3 0,16.74; EN 0,15.47; GND1 0,18.01; GND3 18,18.01; IO0 18,1.5; IO4 18,2.77; IO5 18,6.58; IO12 0,1.5; IO14 0,2.77; IO16 18,4.04; IO17 18,5.31; IO18 18,7.85; IO19 18,9.12; IO21 18,11.66; IO22 18,15.47; IO23 18,16.74; IO25 0,6.58; IO26 0,5.31; IO27 0,4.04; IO32 0,9.12; IO33 0,7.85; IO34 0,11.66; IO35 0,10.39; NC 18,10.39; RX 18,12.93; SENSOR_VN 0,12.93; SENSOR_VP 0,14.2; TX 18,14.2 | smd 0.9 x 3: CLK 9.635,0; CMD 8.365,0; GND2 3.285,0; IO2 14.715,0; IO13 4.555,0; IO15 13.445,0; SD0 10.905,0; SD1 12.175,0; SD2 5.825,0; SD3 7.095,0 | smd 5 x 5: GND4 8,10.5 | smd 5 x 5 bottom: GND5 8,10.5

### Placement (x,y rotation side)
3.3V  97.54,34.8 180 top
3V3_1  70.99,3.43 180 top
5V  29.21,34.16 0 top
5V1  89.28,14.61 270 top
12V_TUNİK_MOTOR  89.42,93.59 0 top
12VOLT  29.2,16.64 0 top
+5V  71.12,19.94 0 top
+12V  40.26,29.34 0 top
-5V  83.06,30.86 0 top
-12V  56.13,29.34 0 top
_5VOLT  40.41,69.49 0 top
ADC_IN  52.07,93.47 180 top
C1  89.53,24.64 90 top
C2  76.83,30.86 0 top
C3  89.28,8.76 270 top
C4  19.05,11.94 0 top
C5  70.99,8.51 90 top
C6  29.34,22.48 90 top
C7  19.18,34.16 0 top
C8  48.51,16.76 0 top
C9  48.51,29.34 180 top
C10  56.13,22.99 270 top
C16  75.44,39.24 180 top
EMG_CONNECTION  77.11,93.45 180 top
F1  17.65,5.21 0 top
GND13  89.28,3.43 180 top
GND18  71,14.74 180 top
GND19  56.17,69.51 0 top
GND20  56.16,17.26 0 top
GND21  71.11,30.87 0 top
GND_  29.21,11.92 0 top
GND_1  85.09,34.8 180 top
J1  49.91,8.26 270 top
JP4  68.96,53.09 270 top
JP5  67.82,42.42 270 top
LED1  96.65,45.72 180 top
LED2  96.39,59.56 90 top
LED3  96.39,73.66 90 top
LED4  35.69,5.21 0 top
MOTOR  26.02,93.51 180 top
R1  81.79,39.24 0 top
R2  8.26,23.37 270 top
R3  81.79,58.17 0 top
R4  81.79,72.39 0 top
R5  75.31,25.27 90 top
R6  29.34,5.97 270 top
R10  71.25,25.15 90 top
R11  81.79,44.7 0 top
R12  81.79,50.42 0 top
R14  91.44,44.7 0 top
R15  91.44,39.24 0 top
R16  91.44,50.42 0 top
R18  75.44,44.7 0 top
R19  75.44,50.42 0 top
R30  31.46,60.2 90 top
R31  31.52,70.53 90 top
R32  25.52,60.2 90 top
R33  25.52,70.53 90 top
R34  19.58,60.32 90 top
R35  19.52,70.53 90 top
R36  13.64,60.32 90 top
R37  13.52,70.53 90 top
R38  7.45,60.32 90 top
R39  7.52,70.53 90 top
T1  31.47,79 0 top
T2  25.66,79 0 top
T3  19.34,79 0 top
T4  13.4,79 0 top
T5  7.46,79 0 top
T6  86.49,39.24 270 top
T7  86.49,44.7 270 top
T8  86.49,50.42 270 top
U1  82.55,23.88 90 top
U2  17.91,22.48 180 top
U3  48.51,22.99 90 top
U$1  25.4,22.48 90 top
U$2  8.26,12.95 270 top
U$3  79.5,-3.56 180 top
U$7  40.26,37.34 0 top

### Tracks (layer width: path | path; a pad name or v marks a point on that pad's centre or on a via)
3.3V  (via drill 0.35)
  Top 0.889: ADC_IN.13 38.76,96.01 37.34,97.43 36.27,97.43 34.49,95.66 34.49,83.92 | 34.49,83.92 34.49,71.83 v33.43,70.76 | v38.05,54.59 38.41,54.23 40.18,54.23 U$7.3V3 | v48.01,85.88 48.01,90.5 49.25,91.75 52.63,91.75 58.32,97.43 62.41,97.43 63.83,96.01 64.36,96.01 EMG_CONNECTION.13 | v43.92,81.79 39.65,81.79 37.52,83.92 34.49,83.92 | C5.1 71.12,6.93 71.12,3.56 3V3_1.1 71.48,3.38 71.83,3.02 77.52,3.02 79.48,4.98 79.48,5.33 U$3.OUT | R18.2 76.28,44.81 76.28,50.32 R19.2 76.63,50.67 79.48,50.67 81.43,52.63 94.23,52.63 97.97,48.9 97.97,44.09 97.43,43.56 LED1.COMMON_CATHODE 97.97,42.49 97.97,40.01 97.61,39.65 97.61,34.85 3.3V.TP
  Bottom 0.889: v33.43,70.76 33.43,70.05 38.05,65.43 v38.05,54.59 38.05,49.61 36.98,48.54 36.98,29.87 46.94,19.91 56.36,19.91 70.94,5.33 70.94,3.56 3V3_1.1 | v43.92,81.79 v48.01,85.88 | 84.99,46.23 94.23,46.23 LED1.COMMON_CATHODE | 84.99,46.23 JP5.1 | 84.99,46.23 84.99,30.05 79.65,24.71 79.65,5.33 U$3.OUT
12_IN
  Top 0.889: F1.P$2 19.56,5.33 20.98,6.76 29.34,6.76 R6.1 29.69,6.93 30.94,8.18 49.78,8.18 J1.1
+5V  (via drill 0.35)
  Top 0.889: 5V.1 29.16,34.31 27.38,36.09 20.62,36.09 18.85,34.31 16,34.31 C7.A 15.65,33.96 12.62,33.96 5.87,27.2 5.87,19.38 8.18,17.07 8.18,16 U$2.1 | C3.1 89.43,10.31 89.43,14.58 5V1.1 88.9,14.76 87.48,14.76 80.37,21.87 U1.8 79.83,21.87 72.9,21.87 71.12,20.09 +5V.1 | v69.88,22.94 71.12,24.18 R10.1 | R39.1 7.64,69.7 13.51,69.7 R37.1 13.87,69.34 14.76,68.45 v14.76,68.28 | v21.87,69.52 19.56,69.52 R35.1 | v24,69.52 25.43,69.52 R33.1 | _5VOLT.1 40.36,69.52 31.65,69.52 R31.1 31.47,69.16 30.76,68.45 v30.76,68.1
  Bottom 0.889: U$3.IN 76.81,5.33 76.81,14.05 71.3,19.56 +5V.1 71.12,20.09 69.88,21.34 v69.88,22.94 69.52,23.11 65.08,23.11 48.9,39.29 44.09,39.29 43.56,39.83 43.56,49.61 45.87,51.92 45.87,62.76 40.72,67.92 40.72,69.16 _5VOLT.1 40.54,69.52 49.61,78.59 64.54,78.59 78.59,92.63 78.59,96.37 77.52,97.43 76.63,97.43 75.21,96.01 74.68,96.01 EMG_CONNECTION.9 | v14.76,68.28 20.45,68.28 21.51,69.34 v21.87,69.52 v24,69.52 24.36,69.34 25.25,69.34 26.49,68.1 v30.76,68.1 30.94,67.74 35.56,63.12 35.56,50.49 29.34,44.27 29.34,34.31 5V.1
+12V  (via drill 0.35)
  Top 0.889: C10.1 56.01,24.36 51.56,24.36 50.85,23.65 47.47,23.65 46.76,24.36 46.76,25.43 U3.8 46.23,25.6 42.49,29.34 +12V.1 40.01,28.98 40.01,27.38 29.52,16.89 12VOLT.1 29.16,16.54 23.11,16.54 18.67,12.09 16.18,12.09 C4.A 15.82,11.91 15.82,5.33 F1.P$1 | U2.6 13.87,23.82 10.67,23.82 8.36,26.14 R2.1 | v60.45,92.99 61.34,92.1 86.23,92.1 87.66,93.52 12V_TUNİK_MOTOR.1 | v17.96,97.61 16.54,96.19 16,96.19 MOTOR.12
  Bottom 0.889: U2.6 14.05,23.65 14.58,23.65 21.51,16.71 29.16,16.71 12VOLT.1 | 60.45,96.55 61.34,97.43 64.9,97.43 66.32,96.01 66.85,96.01 EMG_CONNECTION.12 | v60.45,92.99 60.45,96.55 | 35.38,97.61 48.01,97.61 48.72,98.32 58.5,98.32 60.1,96.72 60.45,96.55 | 35.38,97.61 v17.96,97.61 | 35.38,97.61 35.38,71.65 40.18,66.85 40.18,29.34 +12V.1
-5V  (via drill 0.35)  (1 unrouted)
  Top 0.889: 80.01,30.94 83.03,30.94 -5V.1 | 80.01,30.94 78.41,30.94 | 80.01,30.94 80.01,25.78 U1.5 | v79.12,97.43 71.48,97.43 70.05,96.01 69.52,96.01 EMG_CONNECTION.11
  Bottom 0.889: v79.12,97.43 79.83,96.72 79.83,59.38 69.16,48.72 67.74,48.72 66.67,47.65 66.32,47.65 65.61,46.94 65.61,38.05 70.76,32.89 81.08,32.89 83.03,30.94 -5V.1
-12V  (via drill 0.35)
  Top 0.889: U3.5 50.32,25.6 50.32,26.49 49.96,26.85 49.96,29.34 C9.1 -12V.1 | v42.32,37.69 26.67,37.69 5.16,59.21 5.16,92.28 10.31,97.43 11.38,97.43 12.62,96.19 13.16,96.19 MOTOR.13 | v56.54,90.86 61.52,95.83 61.87,95.83 EMG_CONNECTION.14 | v43.92,63.12 v43.92,74.5 | v41.43,63.12 38.76,63.12 36.27,65.61 35.2,65.61 34.67,65.08 34.67,63.3 v41.43,56.54
  Bottom 0.889: -12V.1 56.01,29.34 47.65,37.69 v42.32,37.69 42.14,38.05 41.43,38.76 v41.43,56.54 | v56.54,90.86 56.54,87.12 v43.92,74.5 | v41.43,63.12 v43.92,63.12
ADC1  (via drill 0.35)
  Top 0.508: ADC_IN.14 37.34,96.01 38.58,94.77 39.83,94.77 40.54,95.48 40.54,96.55 38.58,98.5 35.92,98.5 25.43,88.01 25.43,82.68 23.65,80.9 v23.65,75.56 | v41.96,58.32 v35.74,64.54 | v47.12,58.32 v44.81,58.32 | v55.12,41.96 55.12,37.34 U$7.IO2
  Bottom 0.508: v23.65,75.56 24.71,75.56 v35.74,64.54 | v44.81,58.32 v41.96,58.32 | v47.12,58.32 53.7,51.74 53.7,43.38 v55.12,41.96
ADC2  (via drill 0.35)
  Top 0.508: v57.25,72.19 51.03,72.19 50.32,72.9 50.32,73.08 45.52,77.88 45.52,81.61 43.2,83.92 43.2,93.88 41.96,95.12 41.96,96.01 ADC_IN.12 | v60.63,42.32 v64.19,45.87 | v54.23,39.47 53.87,39.12 53.87,37.34 U$7.IO15
  Bottom 0.508: v57.25,72.19 68.99,60.45 68.99,51.38 66.32,48.72 65.96,48.72 64.19,46.94 v64.19,45.87 | v60.63,42.32 59.38,42.32 56.54,39.47 v54.23,39.47
ADC_CLK  (via drill 0.35)
  Top 0.508: v49.78,85.52 49.78,84.99 52.27,82.5 v52.27,73.08 | v56.01,45.34 58.14,45.34 U$7.IO18
  Bottom 0.508: v49.78,85.52 48.36,86.94 48.36,93.88 49.43,94.94 49.43,96.01 ADC_IN.9 | v52.27,73.08 52.27,67.21 56.01,63.48 56.01,55.3 56.9,54.41 56.9,52.81 55.12,51.03 55.12,46.23 v56.01,45.34
ADC_CS  (via drill 0.35)
  Top 0.508: v41.96,79.12 47.12,73.97 v47.12,59.56 | v56.01,44.09 58.14,44.09 U$7.IO5
  Bottom 0.508: v41.96,79.12 41.96,93.34 ADC_IN.5 | v47.12,59.56 54.41,52.27 54.41,45.7 v56.01,44.09
ADC_DRDY  (via drill 0.35)
  Top 0.508: v50.67,82.86 50.67,78.41 51.21,77.88 v51.21,74.5 | v51.92,64.36 51.92,51.03 52.09,50.85 52.09,43.03 48.72,39.65 48.72,37.34 U$7.CMD
  Bottom 0.508: ADC_IN.10 47.83,96.01 49.07,97.26 49.96,97.26 50.67,96.55 v50.67,82.86 | v51.21,74.5 50.32,73.61 50.32,65.96 v51.92,64.36
ADC_MISO  (via drill 0.35)
  Top 0.508: v41.07,80.72 41.6,80.72 48.01,74.32 v48.01,67.56 | v45.34,64.9 45.34,60.1 43.92,58.67 43.92,57.96 46.05,55.83 v46.94,55.83 | v52.45,42.14 55.12,44.81 55.12,45.7 55.83,46.41 58.14,46.41 U$7.IO19
  Bottom 0.508: v41.07,80.72 39.47,82.32 39.47,93.34 ADC_IN.6 | v45.34,64.9 v48.01,67.56 | v46.94,55.83 46.94,54.94 52.09,49.78 52.09,42.49 v52.45,42.14
ADC_MOSI  (via drill 0.35)
  Top 0.508: v36.98,82.86 46.23,73.61 v46.23,64.01 | v56.01,54.05 58.14,54.05 U$7.IO23
  Bottom 0.508: v36.98,82.86 36.98,93.34 ADC_IN.7 | v46.23,64.01 56.01,54.23 v56.01,54.05
B
  Top 0.508: R14.1 90.68,44.63 87.66,44.63 T7.C
B_LED
  Top 0.508: R1.1 80.9,39.12 80.19,39.12 76.28,35.2 70.23,35.2 68.81,33.78 52.09,33.78 49.96,35.92 49.96,37.34 U$7.CLK
ESP32_RESET  (via drill 0.35)
  Top 0.508: v75.21,40.72 76.28,39.65 76.28,39.29 C16.1 | R18.1 74.68,44.63 v74.68,43.2 74.5,43.03 73.97,43.03 70.94,40.01 70.94,39.12 69.16,37.34 v62.94,37.34 | v44.63,40.36 43.74,41.25 43.74,50.67 41.6,52.81 40.36,52.81 U$7.EN | v71.48,45.16 71.48,45.7 67.74,49.43 67.74,51.74 JP4.3
  Bottom 0.508: v75.21,40.72 74.68,41.25 v74.68,43.2 72.72,45.16 v71.48,45.16 | v44.63,40.36 51.03,40.36 54.05,37.34 v62.94,37.34
G
  Top 0.508: R16.1 90.68,50.49 87.66,50.49 T8.C
G_LED
  Top 0.508: R11.1 80.9,44.63 79.12,44.63 76.1,41.6 74.68,41.6 72.36,39.29 72.36,38.41 68.45,34.49 52.63,34.49 51.21,35.92 51.21,37.34 U$7.SD0
GND  (via drill 0.35)  (2 unrouted)
  Top 0.889: EMG_CONNECTION.8 77.17,95.83 88.9,95.83 91.03,93.7 12V_TUNİK_MOTOR.2 | v86.77,49.25 86.59,49.25 86.41,49.43 85.52,49.43 T8.E | U$7.GND3 58.32,55.47 59.74,55.47 60.1,55.83 66.14,55.83 67.56,54.41 JP4.1 68.1,54.41 70.23,54.41 JP4.2 70.59,54.59 94.59,54.59 97.79,57.78 97.79,58.85 96.55,60.1 96.55,60.81 LED2.K | U$7.GND4 48.36,48.01 v48.36,51.03 48.54,51.38 48.54,52.45 49.96,53.87 49.96,65.08 54.23,69.34 55.83,69.34 GND19.1 56.19,69.52 57.25,69.52 59.21,71.48 59.21,84.81 57.52,86.5 | v49.61,90.5 53.52,90.5 57.52,86.5 | v57.78,86.77 57.52,86.5 | 29.96,72.45 29.52,72.01 29.52,66.67 40.18,56.01 40.18,55.47 U$7.GND1 | 29.96,72.45 32.36,74.85 32.36,77.88 T1.2 | T5.2 8.53,78.05 8.53,78.94 9.07,79.48 9.07,94.41 10.67,96.01 MOTOR.14 | v15.29,81.61 15.29,79.83 14.4,78.94 14.4,78.05 T4.2 | v19.38,76.63 20.27,77.52 20.27,77.88 T3.2 | v25.6,76.63 26.49,77.52 26.49,77.88 T2.2 | v28.8,73.61 29.96,72.45 | 43.56,35.56 46.94,32.18 46.94,29.34 C9.2 | 43.56,35.56 43.56,37.34 U$7.GND2 | C7.C 22.4,34.14 22.4,26.49 U2.4 22.05,26.14 23.29,26.14 25.07,24.36 U$1.A 25.43,24 29.34,24 C6.2 29.69,24.18 40.89,35.38 43.2,35.38 43.56,35.56 | C4.C 22.4,11.91 29.16,11.91 GND_.1 | T7.E 85.34,43.74 83.39,43.74 77.34,37.69 75.56,37.69 74.5,38.76 74.5,39.12 C16.2 74.14,38.58 73.61,38.05 v73.25,38.05 | 73.25,30.94 71.12,30.94 GND21.1 | 73.25,30.94 75.39,30.94 | T6.E 85.34,38.23 85.17,38.05 85.17,34.85 GND_1.TP 84.99,34.49 84.99,28.09 83.39,26.49 83.39,24.54 | 76.81,24.36 79.83,24.36 U1.6 80.37,24.54 83.39,24.54 | 76.81,24.36 75.39,24.36 R5.1 74.85,24.36 73.79,24.36 71.3,21.87 70.23,21.87 68.63,20.27 68.63,17.42 68.45,17.07
  Top 0.889: 83.39,24.54 84.99,24.54 U1.3 | 75.74,30.58 75.74,28.27 76.81,27.2 76.81,24.36 | 73.25,30.94 v73.25,34.14 | C10.2 56.19,21.51 56.19,17.42 GND20.1 56.54,17.07 68.45,17.07 | v49.07,18.67 49.07,20.45 U3.3 | 89.43,5.33 89.43,3.56 GND13.1 | 89.43,5.33 89.43,7.29 C3.2 | 89.43,5.33 U$3.GND 81.97,5.69 77.88,9.78 71.48,9.78 C5.2 71.12,9.96 71.12,14.58 GND18.1 70.59,14.94 68.45,17.07
  Bottom 0.889: v86.77,49.25 86.77,51.21 LED2.K 96.55,61.16 97.79,62.41 97.79,72.9 96.55,74.14 96.55,74.85 LED3.K 96.37,75.39 91.21,80.54 91.21,93.52 12V_TUNİK_MOTOR.2 | EMG_CONNECTION.10 72.01,95.83 69.7,93.52 EMG_CONNECTION.4 69.34,93.34 68.1,92.1 66.32,92.1 65.08,93.34 64.54,93.34 EMG_CONNECTION.6 64.19,93.17 v57.78,86.77 | v48.36,51.03 48.36,48.01 U$7.GND4 | v49.61,90.5 49.61,93.34 ADC_IN.2 | 61.16,53.7 61.7,54.23 67.56,54.23 JP4.1 | 61.16,53.7 60.1,53.7 57.96,55.83 57.96,67.56 56.19,69.34 GND19.1 | MOTOR.11 18.31,96.19 17.6,96.19 16.36,97.43 12.09,97.43 11.02,96.37 MOTOR.14 10.67,96.01 9.42,94.77 9.42,92.99 15.29,87.12 v15.29,81.61 15.47,81.25 19.38,77.34 v19.38,76.63 v25.6,76.63 25.96,76.45 v28.8,73.61 28.98,73.25 28.98,72.9 36.8,65.08 36.8,49.96 35.74,48.9 35.74,19.91 33.43,17.6 31.65,17.6 31.29,17.42 | 46.76,2.31 40.01,2.31 37.34,4.98 LED4.K 36.8,5.33 36.27,5.33 29.69,11.91 29.34,11.91 GND_.1 29.87,12.27 31.29,13.69 31.29,17.42 | 46.76,2.31 49.78,2.31 J1.2 | 31.29,17.42 22.58,26.14 22.05,26.14 U2.4 | JP5.4 67.92,38.58 72.72,38.58 v73.25,38.05 v73.25,34.14 | GND20.1 56.01,17.42 54.76,18.67 v49.07,18.67 48.9,18.31 46.76,16.18 46.76,2.31 | 61.16,53.7 61.34,53.34 61.34,52.27 62.23,51.38 62.23,39.65 70.94,30.94 GND21.1
  pour Top: -7.87,104.27 -7.87,-20.57 115.44,-20.57 115.44,104.78 115.7,105.03 -7.24,105.03 -7.87,104.39
  pour Bottom: -16.13,-23.62 -7.49,-32.26 122.43,-32.26 122.68,-32.51 122.68,111.63 122.94,111.89 -10.03,111.89 -16.26,105.66 -16.13,105.54 -16.13,105.16
IC1  (via drill 0.35)
  Top 0.508: v52.81,51.38 52.81,55.3 56.72,59.21 84.81,59.21 97.61,72.01 97.61,89.43 88.54,98.5 70.41,98.5 68.28,96.37 68.28,95.48 68.99,94.77 69.88,94.77 71.12,93.52 72.01,93.52 EMG_CONNECTION.3 | v56.01,41.25 56.01,40.89 56.72,40.18 58.14,40.18 U$7.IO4
  Bottom 0.508: v52.81,51.38 52.81,43.03 54.76,41.07 55.83,41.07 v56.01,41.25
IC2  (via drill 0.35)
  Top 0.508: v68.28,47.65 65.08,47.65 v64.36,48.36 | v63.3,43.74 60.98,41.43 58.32,41.43 U$7.IO16
  Bottom 0.508: v68.28,47.65 69.52,47.65 80.9,59.03 80.9,97.08 79.48,98.5 70.41,98.5 68.28,96.37 68.28,95.66 67.39,94.77 64.01,94.77 62.76,93.52 62.05,93.52 EMG_CONNECTION.7 | v64.36,48.36 63.3,47.3 v63.3,43.74
IO_9  (via drill 0.35)
  Top 0.508: ADC_IN.4 44.45,94.41 45.87,95.83 45.87,96.55 46.58,97.26 v52.45,97.26 | v55.12,87.3 55.12,75.56 58.14,72.54 58.14,71.83 57.61,71.3 54.76,71.3 48.9,65.43 48.9,54.23 45.16,50.49 45.16,42.14 46.23,41.07 46.23,37.34 U$7.SD2
  Bottom 0.508: v52.45,97.26 55.12,94.59 v55.12,87.3
IO_11  (via drill 0.35)
  Top 0.508: v54.23,91.75 60.27,85.7 60.27,71.12 54.41,65.25 51.56,65.25 51.03,64.72 51.03,50.85 51.38,50.49 51.38,43.38 47.47,39.47 47.47,37.34 U$7.SD3
  Bottom 0.508: v54.23,91.75 54.23,93.34 52.09,95.48 52.09,96.01 ADC_IN.8
IO_13  (via drill 0.35)
  Top 0.508: v42.85,73.43 42.85,52.63 44.45,51.03 44.45,41.78 45.52,40.72 45.52,39.47 44.98,38.94 44.98,37.34 U$7.IO13
  Bottom 0.508: ADC_IN.11 44.45,95.12 43.03,93.7 43.03,82.14 42.85,81.97 v42.85,73.43
N$1
  Top 0.508: R11.2 82.68,44.81 84.63,44.81 85.34,45.52 T7.B
N$2
  Top 0.508: R1.2 82.68,39.29 84.45,39.29 85.34,40.18 T6.B
N$3
  Top 0.508: C1.1 89.43,23.29 85.17,23.29 U1.2
N$4
  Top 0.508: C1.2 89.43,25.96 85.34,25.96 85.17,25.78 U1.4
N$5
  Top 0.508: U2.1 U2.8 14.05,18.67 14.05,21.16 U2.7 13.87,20.62 8.36,20.62 R2.2
N$6
  Top 0.508: R14.2 92.28,44.81 95.66,44.81 96.55,45.7 LED1.RED
N$7
  Top 0.508: R12.2 82.68,50.49 84.63,50.49 85.34,51.21 T8.B
N$9
  Top 0.508: C8.1 47.12,16.89 47.12,19.02 47.83,19.74 47.83,20.45 U3.2
N$10
  Top 0.508: 23.11,20.98 22.23,20.98 22.05,21.16 U2.2 | 23.11,20.98 25.25,20.98 U$1.C | 23.11,20.98 23.11,17.96 18.85,13.69 12.09,13.69 8.36,9.96 U$2.2
N$11
  Top 0.508: LED1.BLUE 95.3,39.29 92.28,39.29 R15.2
N$12
  Top 0.508: LED1.GREEN 94.59,50.32 92.28,50.32 R16.2
N$13  (via drill 0.35)
  Top 0.508: R5.2 75.21,26.14 71.3,26.14 R10.2 71.12,26.14 68.1,23.11 55.3,23.11 54.76,22.58 46.76,22.58 44.63,20.45 v34.67,20.45
  Bottom 0.508: v34.67,20.45 27.56,27.56 21.51,27.56 20.27,26.31 14.05,26.31 U2.5
N$14
  Top 0.889: C6.1 29.34,21.16 27.03,21.16 25.43,22.76 22.94,22.76 22.05,23.65 U2.3
N$15
  Top 0.508: C8.2 49.96,16.89 49.96,18.31 50.32,18.67 50.32,20.45 U3.4
N$16
  Top 0.508: U$7.TX 58.32,51.38 60.1,51.38 67.74,43.74 JP5.2
N$17  (via drill 0.35)
  Top 0.508: v56.01,50.67 56.36,50.32 58.14,50.32 U$7.RX | v61.16,39.83 65.43,39.83 66.67,41.07 67.74,41.07 JP5.3
  Bottom 0.508: v56.01,50.67 56.01,46.58 56.9,45.7 56.9,40.89 56.36,40.36 53.87,40.36 53.34,39.83 53.34,39.12 53.87,38.58 59.92,38.58 v61.16,39.83
N$18
  Top 0.508: 72.36,50.49 71.48,50.49 70.23,51.74 JP4.4 | 72.36,50.49 74.5,50.49 R19.1 | 72.36,50.49 72.36,43.2 68.99,39.83 66.5,39.83 65.61,38.94 58.32,38.94 U$7.IO0
N$19
  Top 0.508: R3.2 82.68,58.14 96.37,58.14 LED2.A
N$20  (via drill 0.35)
  Top 0.508: v56.9,56.54 58.5,58.14 80.9,58.14 R3.1 | v60.45,43.38 59.74,42.67 58.32,42.67 U$7.IO17
  Bottom 0.508: v56.9,56.54 56.9,55.47 60.45,51.92 v60.45,43.38
N$21
  Top 0.508: R4.2 82.68,72.36 96.37,72.36 LED3.A
N$22  (via drill 0.35)
  Top 0.508: v53.7,63.48 62.59,72.36 80.9,72.36 R4.1 | v48.01,63.48 48.01,55.65 v44.63,52.27 | v42.49,50.14 42.49,39.65 41.78,38.94 40.36,38.94 U$7.IO12
  Bottom 0.508: v48.01,63.48 v53.7,63.48 | v42.49,50.14 v44.63,52.27
N$25
  Top 0.508: R6.2 29.34,5.16 34.31,5.16 LED4.A
N$45  (via drill 0.35)
  Top 0.508: v28.63,77.88 30.4,77.88 T1.1 | v21.69,77.88 21.69,75.74 18.14,72.19 18.14,68.81 v22.05,64.9 | v27.56,64.9 31.29,61.16 R30.2
  Bottom 0.508: v21.69,77.88 v28.63,77.88 | v27.56,64.9 v22.05,64.9
N$46
  Top 0.508: T2.1 24.54,77.88 24.54,72.72 22.94,71.12 22.94,63.65 25.43,61.16 R32.2
N$47
  Top 0.508: T3.1 18.31,77.88 18.31,73.43 17.42,72.54 17.42,63.48 19.56,61.34 R34.2
N$48
  Top 0.508: T4.1 12.62,77.88 12.62,74.5 15.82,71.3 15.82,63.48 13.69,61.34 R36.2
N$49
  Top 0.508: T5.1 6.4,77.88 6.4,72.54 6.22,72.36 6.22,62.41 7.29,61.34 R38.2
PARMAK_1B
  Top 0.508: R30.1 31.47,59.21 31.47,52.09 38.23,45.34 40.18,45.34 U$7.IO33
PARMAK_2IS
  Top 0.508: R32.1 25.6,59.21 25.6,56.9 38.41,44.09 40.18,44.09 U$7.IO25
PARMAK_3OR
  Top 0.508: R34.1 19.74,59.21 22.23,59.21 38.76,42.67 40.18,42.67 U$7.IO26
PARMAK_4YZ
  Top 0.508: R36.1 13.69,59.21 17.6,59.21 35.38,41.43 40.18,41.43 U$7.IO27
PARMAK_5SR
  Top 0.508: R38.1 7.47,59.21 11.56,59.21 30.58,40.18 40.18,40.18 U$7.IO14
POZ_FB_1  (via drill 0.35)
  Top 0.508: v13.34,87.12 14.58,88.37 14.58,93.88 15.47,94.77 18.85,94.77 19.56,95.48 19.56,96.37 20.45,97.26 26.49,97.26 27.2,96.55 27.2,95.66 26.14,94.59 26.14,93.52 MOTOR.1 | v34.49,55.83 38.76,51.56 40.18,51.56 U$7.SENSOR_VP
  Bottom 0.508: v13.34,87.12 13.34,81.97 13.51,81.79 13.51,68.1 25.78,55.83 v34.49,55.83
POZ_FB_2  (via drill 0.35)
  Top 0.508: v21.69,91.57 21.69,90.5 v12.62,81.43 | v34.49,54.59 38.76,50.32 40.18,50.32 U$7.SENSOR_VN
  Bottom 0.508: v21.69,91.57 23.47,93.34 MOTOR.2 | v12.62,81.43 12.62,67.92 25.96,54.59 v34.49,54.59
POZ_FB_3  (via drill 0.35)
  Top 0.508: v14.22,84.28 20.8,90.86 20.8,93.34 MOTOR.3 | v27.03,69.16 27.03,67.74 33.6,61.16 33.6,54.23 38.76,49.07 40.18,49.07 U$7.IO34
  Bottom 0.508: v14.22,84.28 14.22,80.37 24,70.59 25.6,70.59 v27.03,69.16
POZ_FB_4  (via drill 0.35)
  Top 0.508: v38.05,48.01 40.01,48.01 40.18,47.83 U$7.IO35
  Bottom 0.508: v38.05,48.01 39.12,49.07 39.12,66.32 34.31,71.12 34.31,74.68 18.49,90.5 18.49,93.34 MOTOR.4
POZ_FB_5  (via drill 0.35)
  Top 0.508: v11.73,84.28 15.82,88.37 15.82,93.34 MOTOR.5 | v34.14,50.67 38.23,46.58 40.18,46.58 U$7.IO32
  Bottom 0.508: v11.73,84.28 11.73,67.74 28.8,50.67 v34.14,50.67
PWM_OUTPUT_1_1B  (via drill 0.35)
  Top 0.508: R31.2 31.65,71.48 33.43,73.25 33.43,78.77 32.18,80.01 31.47,80.01 T1.3 31.29,80.19 v27.56,80.19
  Bottom 0.508: v27.56,80.19 14.4,93.34 13.34,93.34 MOTOR.6
PWM_OUTPUT_2_2IS  (via drill 0.35)
  Top 0.508: R33.2 25.6,71.48 27.74,73.61 27.74,78.77 26.49,80.01 25.78,80.01 T2.3 25.43,80.19 25.07,80.54 v24.54,80.54
  Bottom 0.508: v24.54,80.54 11.73,93.34 10.85,93.34 MOTOR.7
PWM_OUTPUT_3_3OR
  Top 0.508: 20.8,80.01 19.38,80.01 T3.3 | 20.8,80.01 22.58,78.23 22.58,74.5 19.56,71.48 R35.2 | 20.8,80.01 24.71,83.92 24.71,94.23 25.96,95.48 25.96,96.01 MOTOR.8
PWM_OUTPUT_4_4YZ
  Top 0.508: R37.2 11.38,73.61 11.38,78.77 12.62,80.01 13.34,80.01 T4.3 13.51,80.19 13.51,81.25 22.58,90.32 22.58,91.92 22.23,92.28 22.23,93.88 23.47,95.12 23.47,96.01 MOTOR.9
PWM_OUTPUT_5_5SR  (via drill 0.35)
  Top 0.508: v6.22,79.3 6.93,80.01 7.29,80.01 T5.3 | R39.2 7.47,71.48 7.29,71.65 v7.29,72.72 10.13,75.56 10.13,81.43 19.56,90.86 19.56,93.7 20.8,94.94 20.8,96.01 MOTOR.10
  Bottom 0.508: v6.22,79.3 6.22,73.79 v7.29,72.72
R
  Top 0.508: R15.1 90.68,39.29 87.66,39.29 T6.C
R_LED
  Top 0.508: R12.1 80.9,50.32 80.9,47.47 75.74,42.32 74.32,42.32 71.65,39.65 71.65,38.76 68.1,35.2 53.16,35.2 52.45,35.92 52.45,37.34 U$7.SD1
SCL_ADC  (via drill 0.35)
  Top 0.508: v50.32,77.52 46.94,80.9 46.94,93.34 ADC_IN.3 | v60.63,54.76 60.63,53.7 59.92,52.98 58.32,52.98 U$7.IO22
  Bottom 0.508: v50.32,77.52 50.67,77.52 60.63,67.56 v60.63,54.76
SDA_ADC  (via drill 0.35)
  Top 0.508: v51.21,73.25 46.23,78.23 46.23,81.97 45.87,82.32 45.87,94.06 46.41,94.59 50.14,94.59 51.21,93.52 51.92,93.52 ADC_IN.1 | v55.12,56.36 55.12,50.32 56.36,49.07 58.14,49.07 U$7.IO21
  Bottom 0.508: v51.21,73.25 51.21,67.21 55.12,63.3 v55.12,56.36

### Text on the board
tNames: 14 | 8 | 14 | 8 | 14 | 8 | 8 | 1 | 7 | 1 | 1 | 7 | 1 | 7 | 12V | GND | BOOT-RST | MAREL ARGE | 7 | V1.2 | GND-RX-TX-3.3V | F1